# Altium schematic sheet Snippet_LM1117MP-3.3.SchDoc
size 1188 x 840 mm
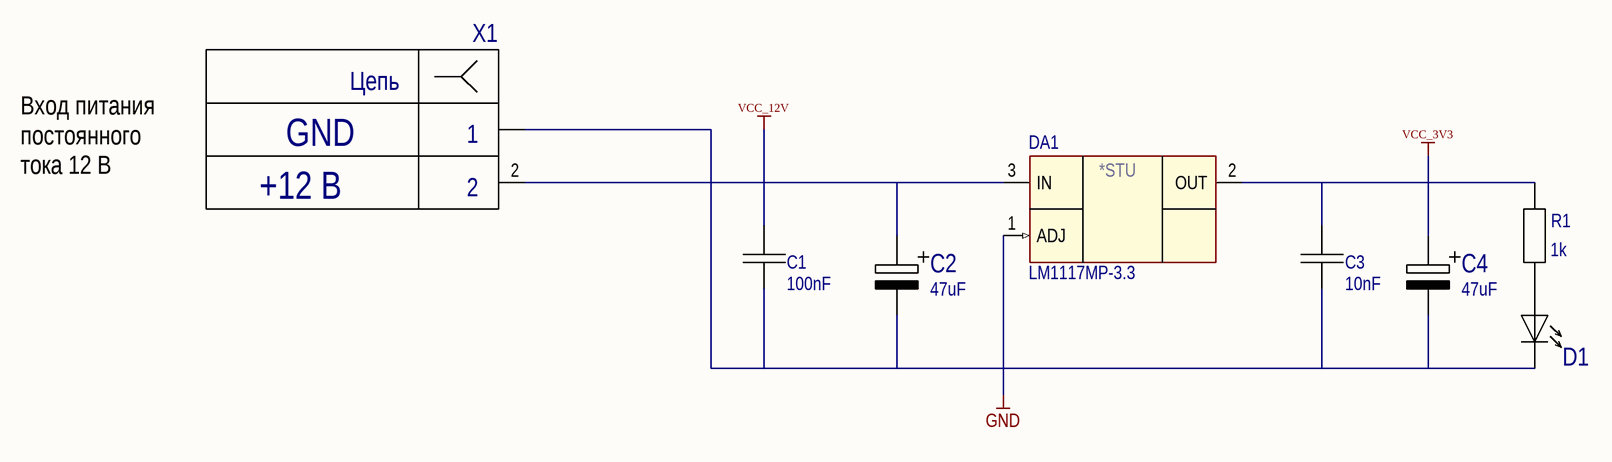
[diagram p0: Snippet_LM1117MP-3.3.SchDoc]

## Parts
C1  100nF  [Capacitor_0805]
C2  47uF  [Capacitor_Electrolit_6.3x11]
C3  10nF  [Capacitor_0805]
C4  47uF  [CAPACITOR+_22uFx25V]
D1  LED_2.54mm_R  [LED_2.54mm_R]  (value not drawn)
DA1  LM1117MP-3.3  [NCP1117_SOT223]
R1  1k  [RESISTOR_SMD0805]
X1  Connector_DG350-3.5-02P-14  [CONNECTOR_DG350-3.5-02P-14]  (value not drawn)

## Nets
GND: C1.2 C2.2 C3.2 C4.2 D1.1 DA1.1(ADJ) X1.1
VCC_3V3: C3.1 C4.1 DA1.2(OUT) R1.2
VCC_12V: C1.1 C2.1 DA1.3(IN) X1.2
NetD1_2: D1.2 R1.1

## Notes on the sheet
- Вход питания постоянного
  тока 12 В
- +12 В
- GND
- (in symbol Connector_DG350-3.5-02P-14) Цепь
- (in symbol LM1117MP-3.3) *STU

## Library data of the parts
C1 C3 = Capacitor_0805
C2 = Capacitor+_6.3x11
C4 = Capacitor+_22uFx25V
R1 = Resistor_0805